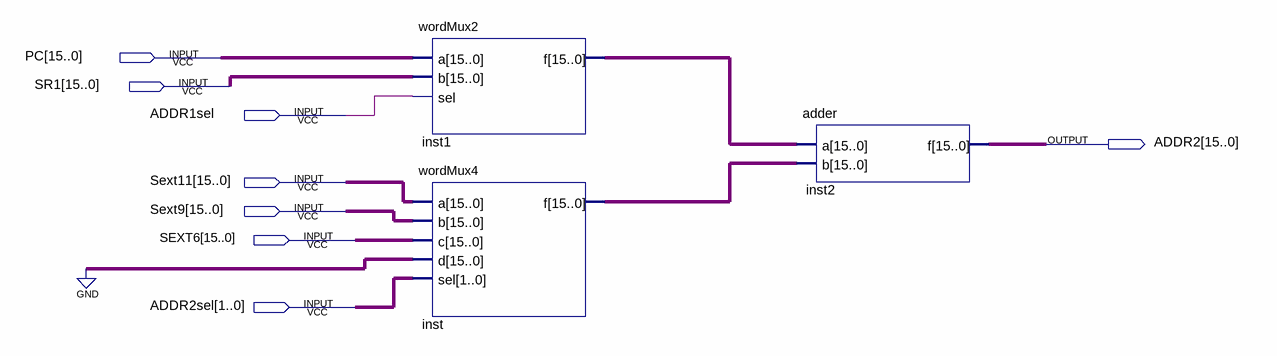
[diagram p0: schematic sheet]
// Quartus schematic addrAdd.bdf as structural Verilog: 3 symbols, 8 pins
module addrAdd (
  input  [15:0] PC,
  input  [15:0] SR1,
  input  ADDR1sel,
  input  [15:0] Sext11,
  input  [15:0] Sext9,
  input  [15:0] SEXT6,
  input  [1:0] ADDR2sel,
  output [15:0] ADDR2
);

  wire [15:0] inst1_f, inst_f;

  wordMux2 inst1 (.a(PC), .b(SR1), .sel(ADDR1sel), .f(inst1_f));
  wordMux4 inst (.a(Sext11), .b(Sext9), .c(SEXT6), .d({16{1'b0}}), .sel(ADDR2sel), .f(inst_f));
  adder inst2 (.a(inst1_f), .b(inst_f), .f(ADDR2));
endmodule
